# EAGLE schematic NMEA2000-DS1820 (EAGLE 9.6.2)
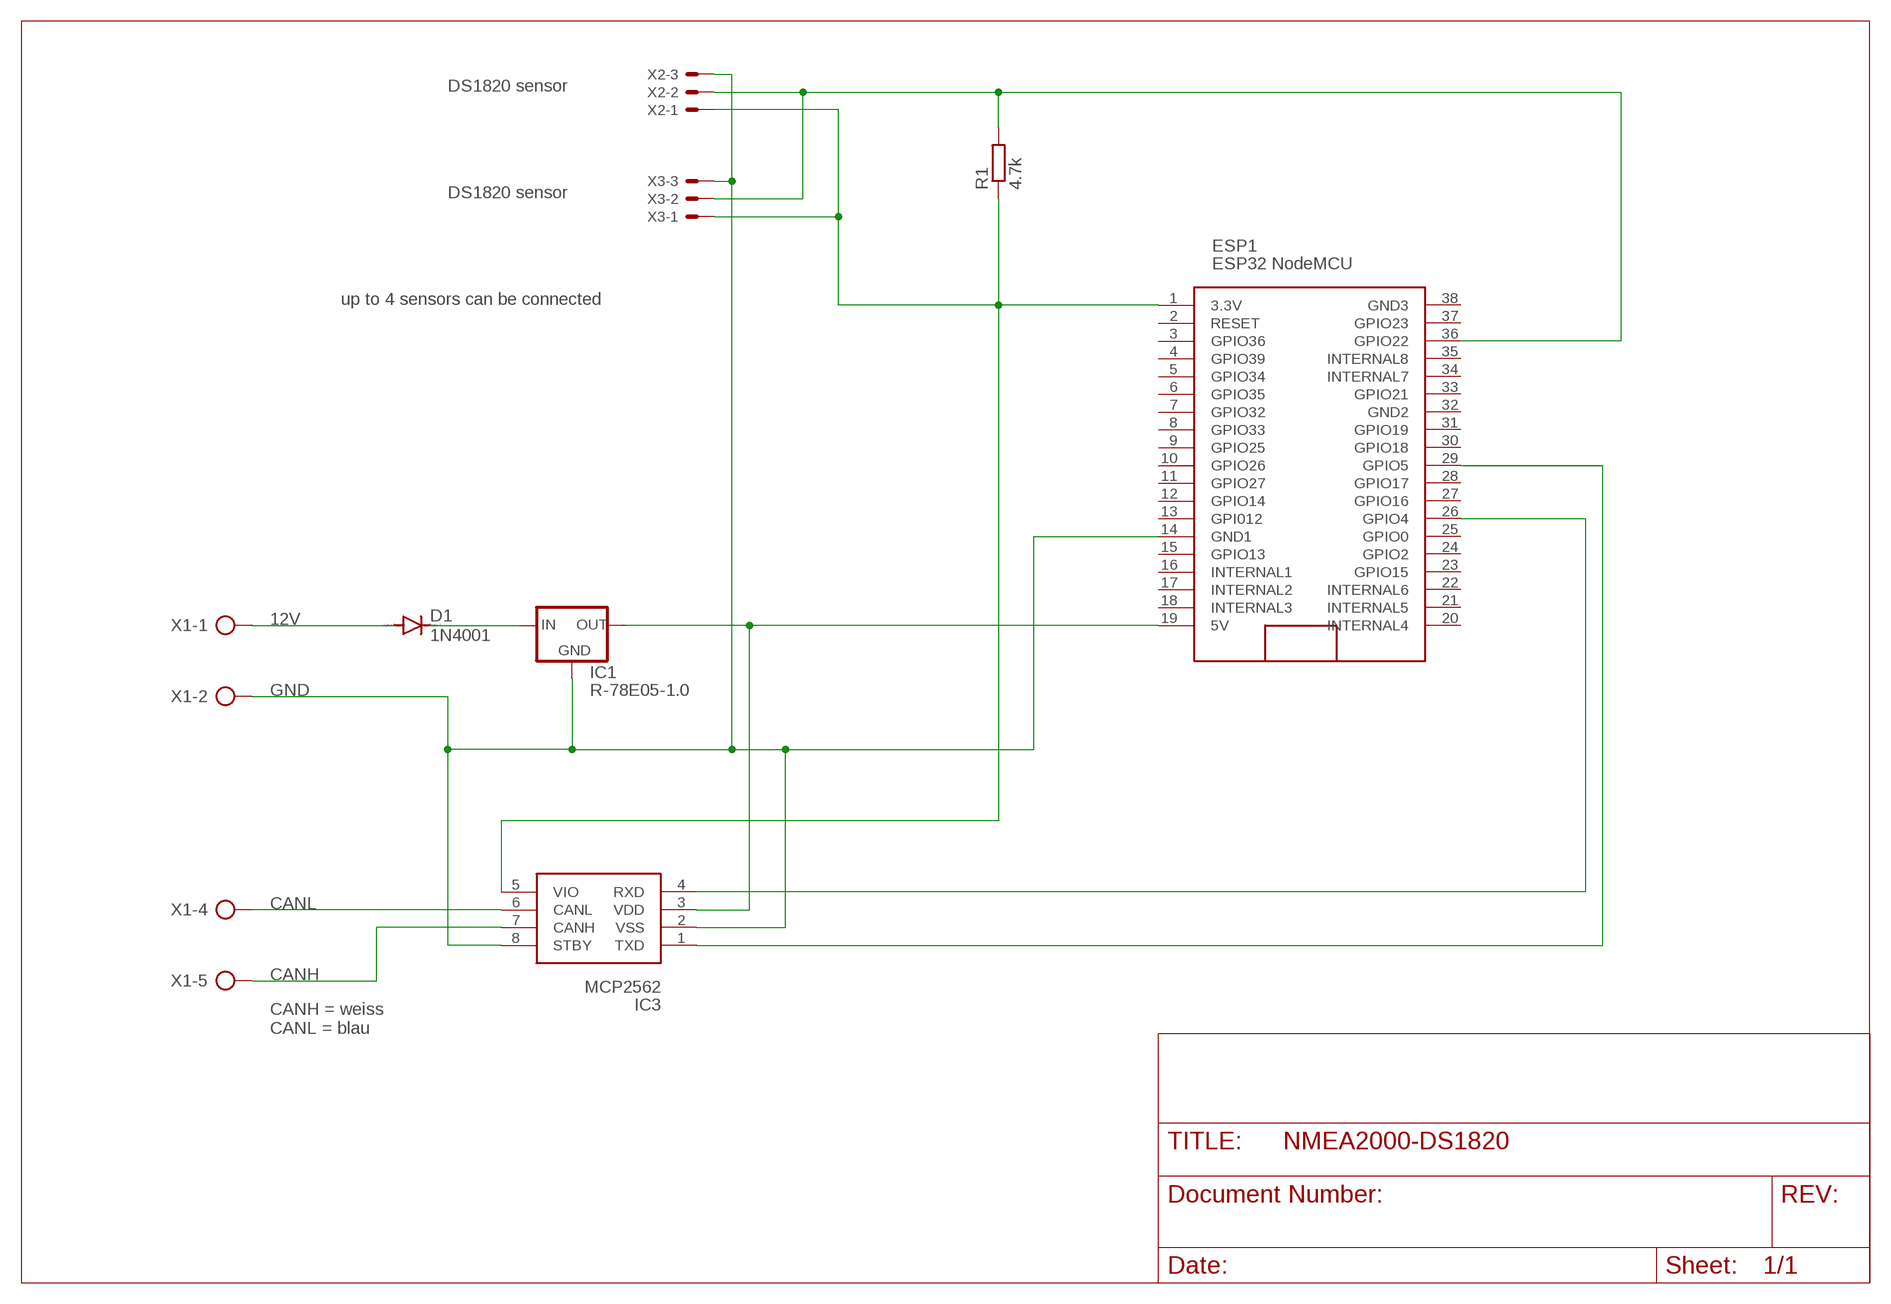
[diagram p0: schematic, sheet 1]

## Parts
D1  1N4001  1N4004  [DO41-10]
ESP1  ESP32 NodeMCU  ESP32-NODEMCU  [ESP32_NODEMCU]
IC1  R-78E05-1.0  78XXS  [78XXS]
IC3  MCP2562  [DIL08]
R1  4.7k  R-EU_0204/7  [0204/7]
X1  AK500/5  [AK500/5]
X2  22-23-2031  [22-23-2031]
X3  22-23-2031  [22-23-2031]

## Nets
12V: D1.A X1.1
CANH: IC3.7(CANH) X1.5
CANL: IC3.6(CANL) X1.4
GND: ESP1.14(GND1) IC1.GND IC3.2(VSS) IC3.8(STBY) X1.2 X2.3 X3.3
N$1: ESP1.26(GPIO4) IC3.4(RXD)
N$2: ESP1.29(GPIO5) IC3.1(TXD)
N$3: ESP1.19(5V) IC1.OUT IC3.3(VDD)
N$4: ESP1.36(GPIO22) R1.2 X2.2 X3.2
N$5: D1.C IC1.IN
N$8: ESP1.1(3.3V) IC3.5(VIO) R1.1 X2.1 X3.1
Unconnected: ESP1.2(RESET) ESP1.3(GPIO36) ESP1.4(GPIO39) ESP1.5(GPIO34) ESP1.6(GPIO35) ESP1.7(GPIO32) ESP1.8(GPIO33) ESP1.9(GPIO25) ESP1.10(GPIO26) ESP1.11(GPIO27) ESP1.12(GPIO14) ESP1.13(GPI012) ESP1.15(GPIO13) ESP1.16(INTERNAL1) ESP1.17(INTERNAL2) ESP1.18(INTERNAL3) ESP1.20(INTERNAL4) ESP1.21(INTERNAL5) ESP1.22(INTERNAL6) ESP1.23(GPIO15) ESP1.24(GPIO2) ESP1.25(GPIO0) ESP1.27(GPIO16) ESP1.28(GPIO17) ESP1.30(GPIO18) ESP1.31(GPIO19) ESP1.33(GPIO21) ESP1.34(INTERNAL7) ESP1.35(INTERNAL8) ESP1.37(GPIO23) X1.3

## Notes on the sheet
- DS1820 sensor
- DS1820 sensor
- up to 4 sensors can be connected
- CANH = weiss
  CANL = blau

## Power pins joined to a net without a drawn wire
GND2: ESP1.32(GND2)
GND3: ESP1.38(GND3)

## Library data of the parts
D1 = diode:1N4004: DIODE general purpose rectifier, 1 A
ESP1 = _esp32:ESP32-NODEMCU
IC1 = v-reg:78XXS: VOLTAGE REGULATOR
IC3 = _eigene:MCP2562
R1 = rcl:R-EU_: RESISTOR, European symbol; SPICEPREFIX: R
X1 = con-ptr500:AK500/5: CONNECTOR; OC_FARNELL: unknown; OC_NEWARK: unknown
X2 X3 = con-molex:22-23-2031: .100" (2.54mm) Center Header - 3 Pin; MF: MOLEX; MPN: 22-23-2031; OC_FARNELL: 1462950; OC_NEWARK: 30C0862